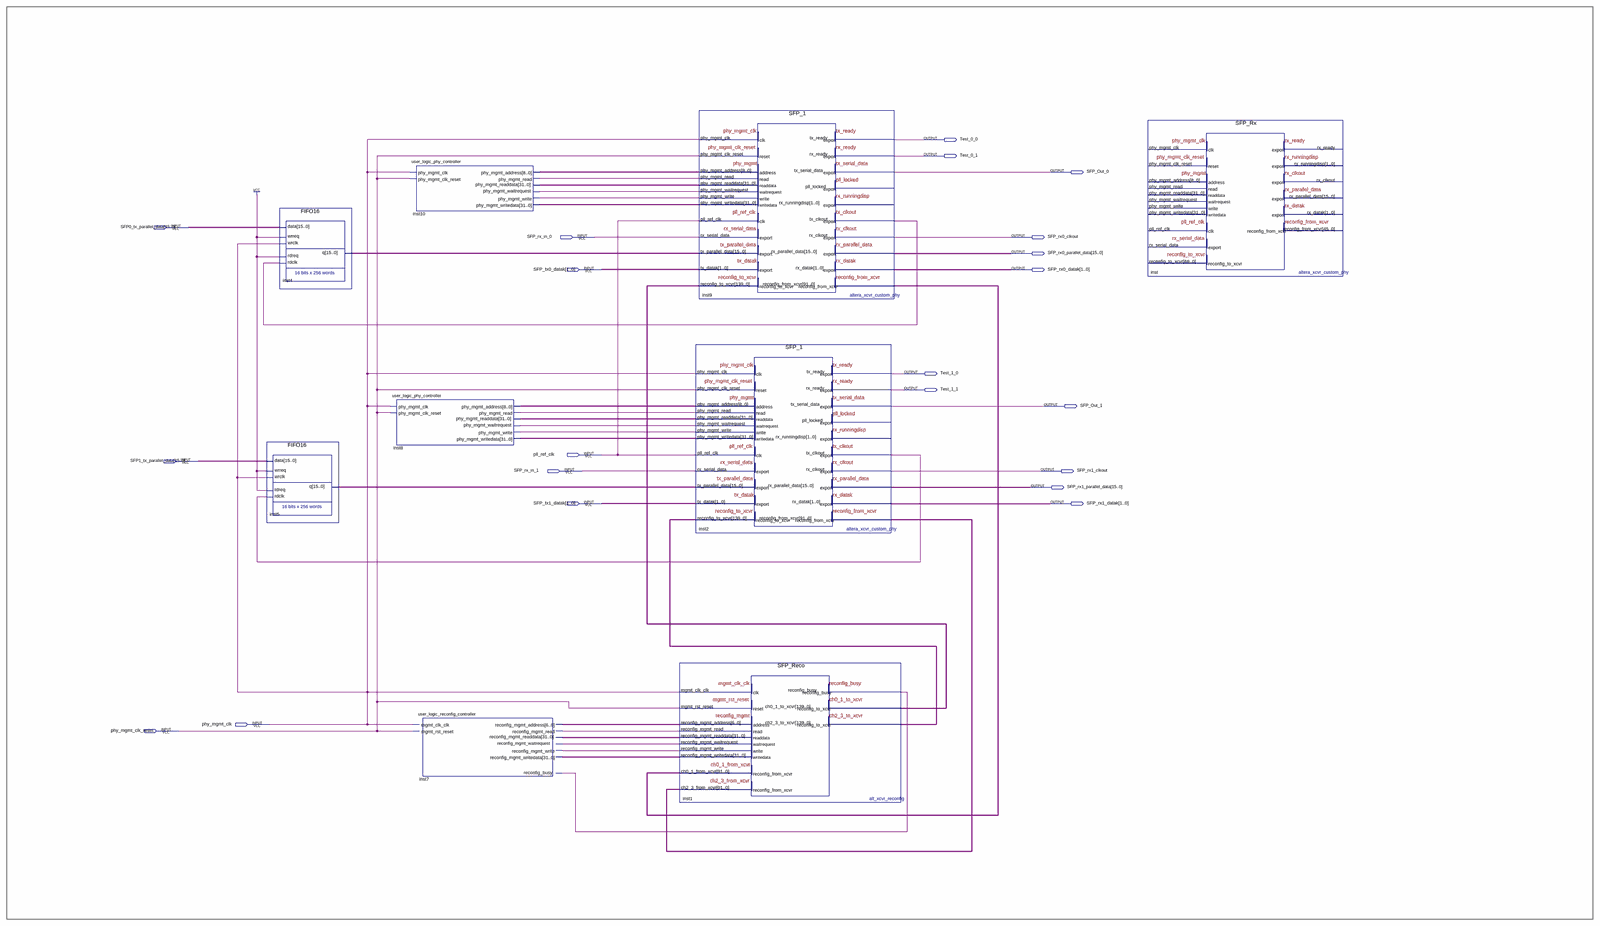
[diagram p0: schematic sheet, whole]
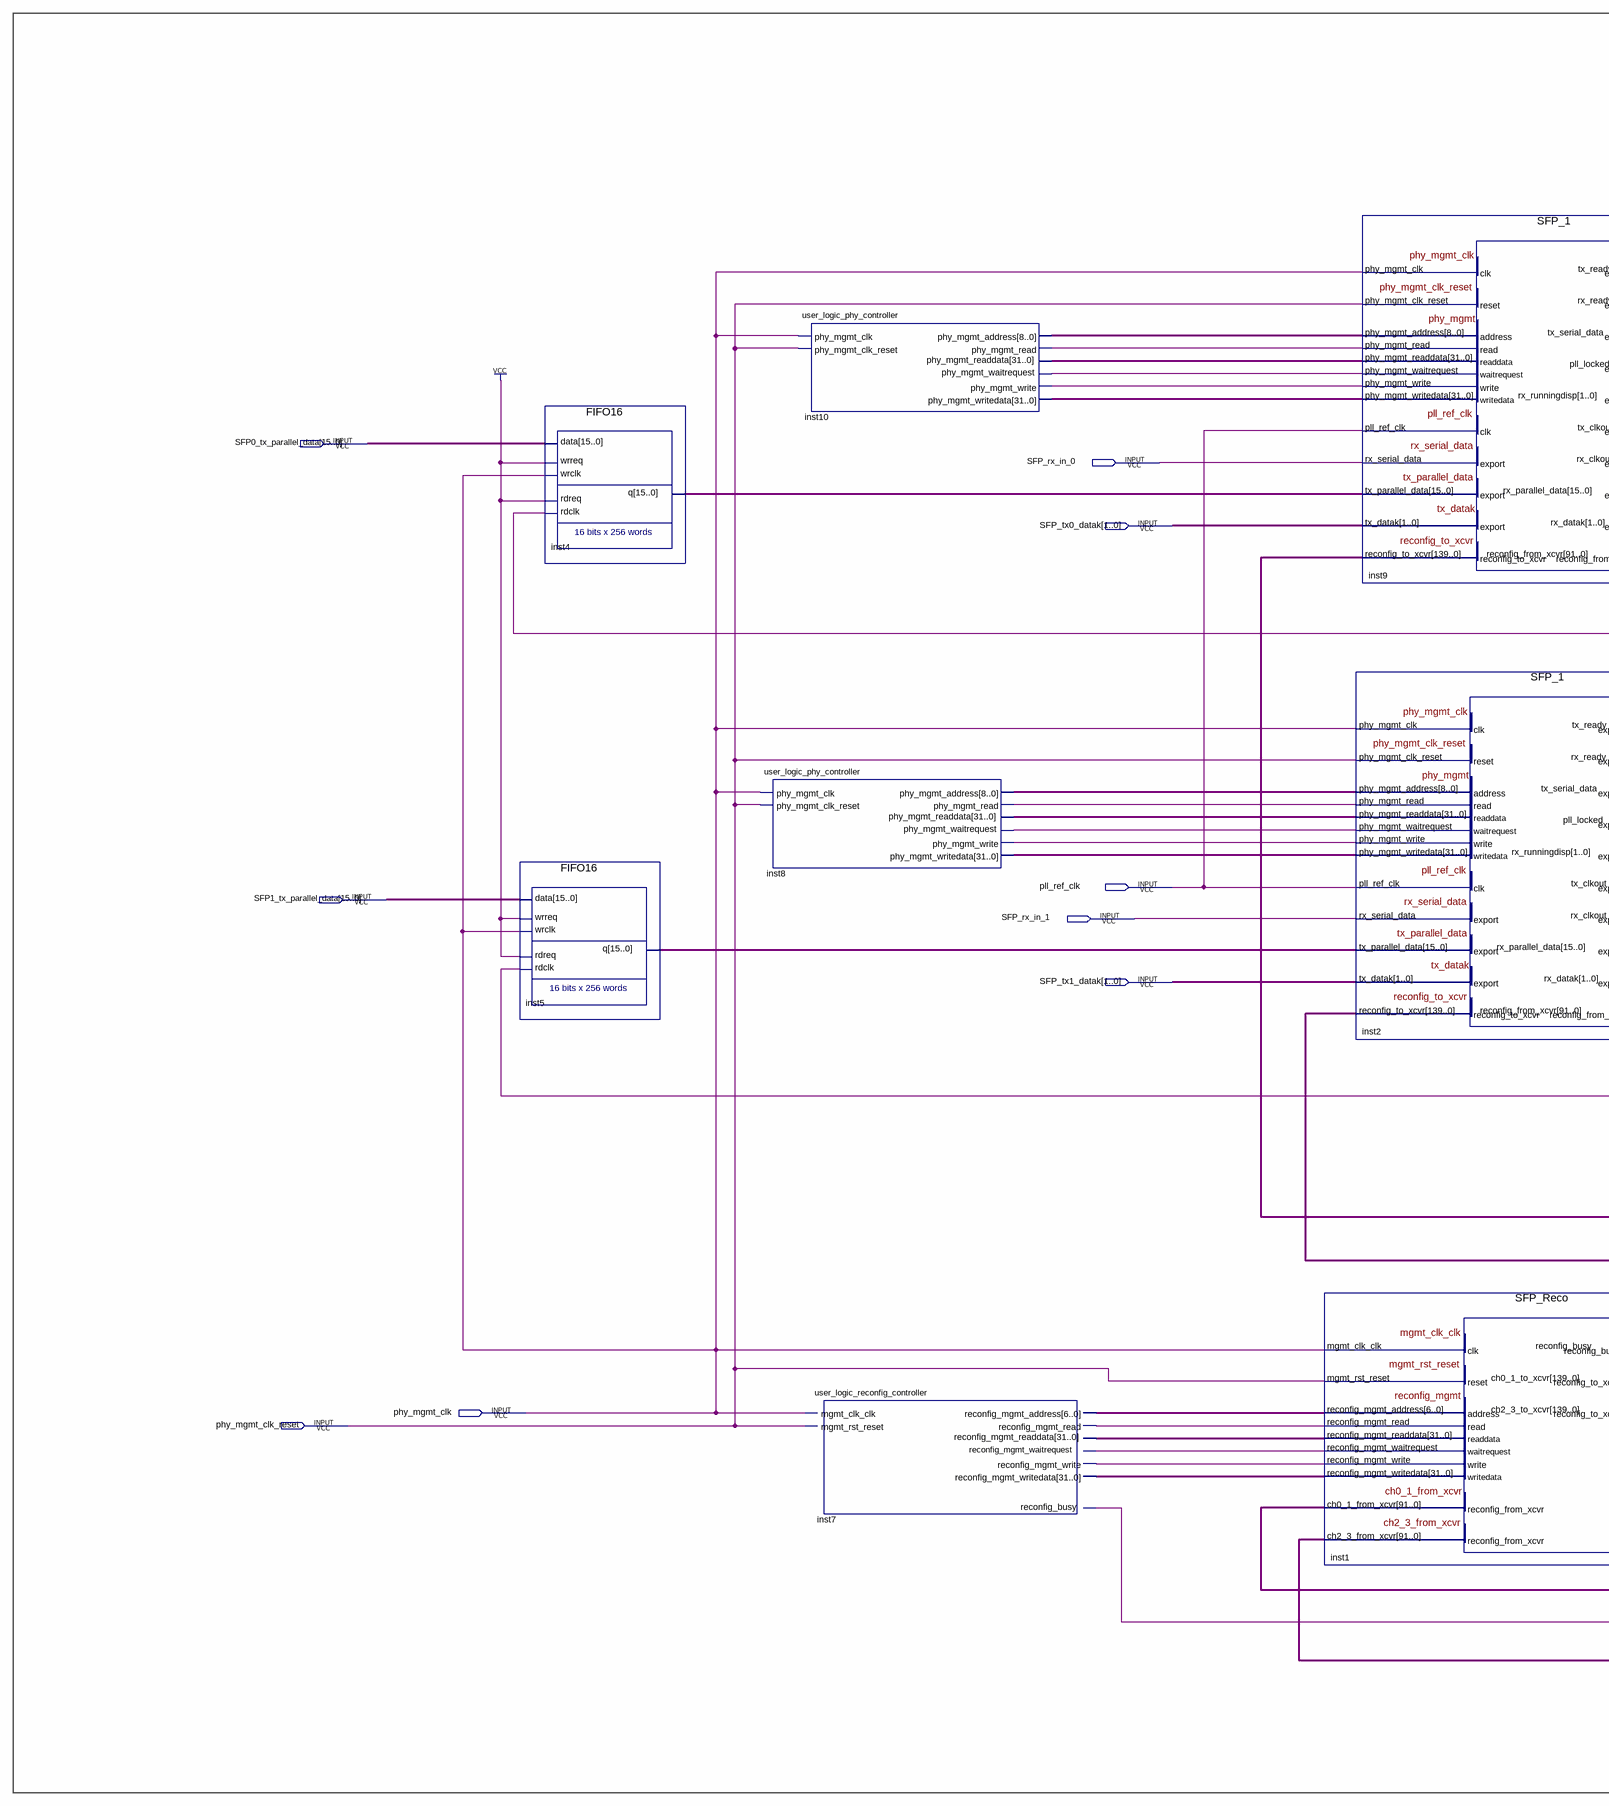
[diagram p1: schematic sheet, left part]
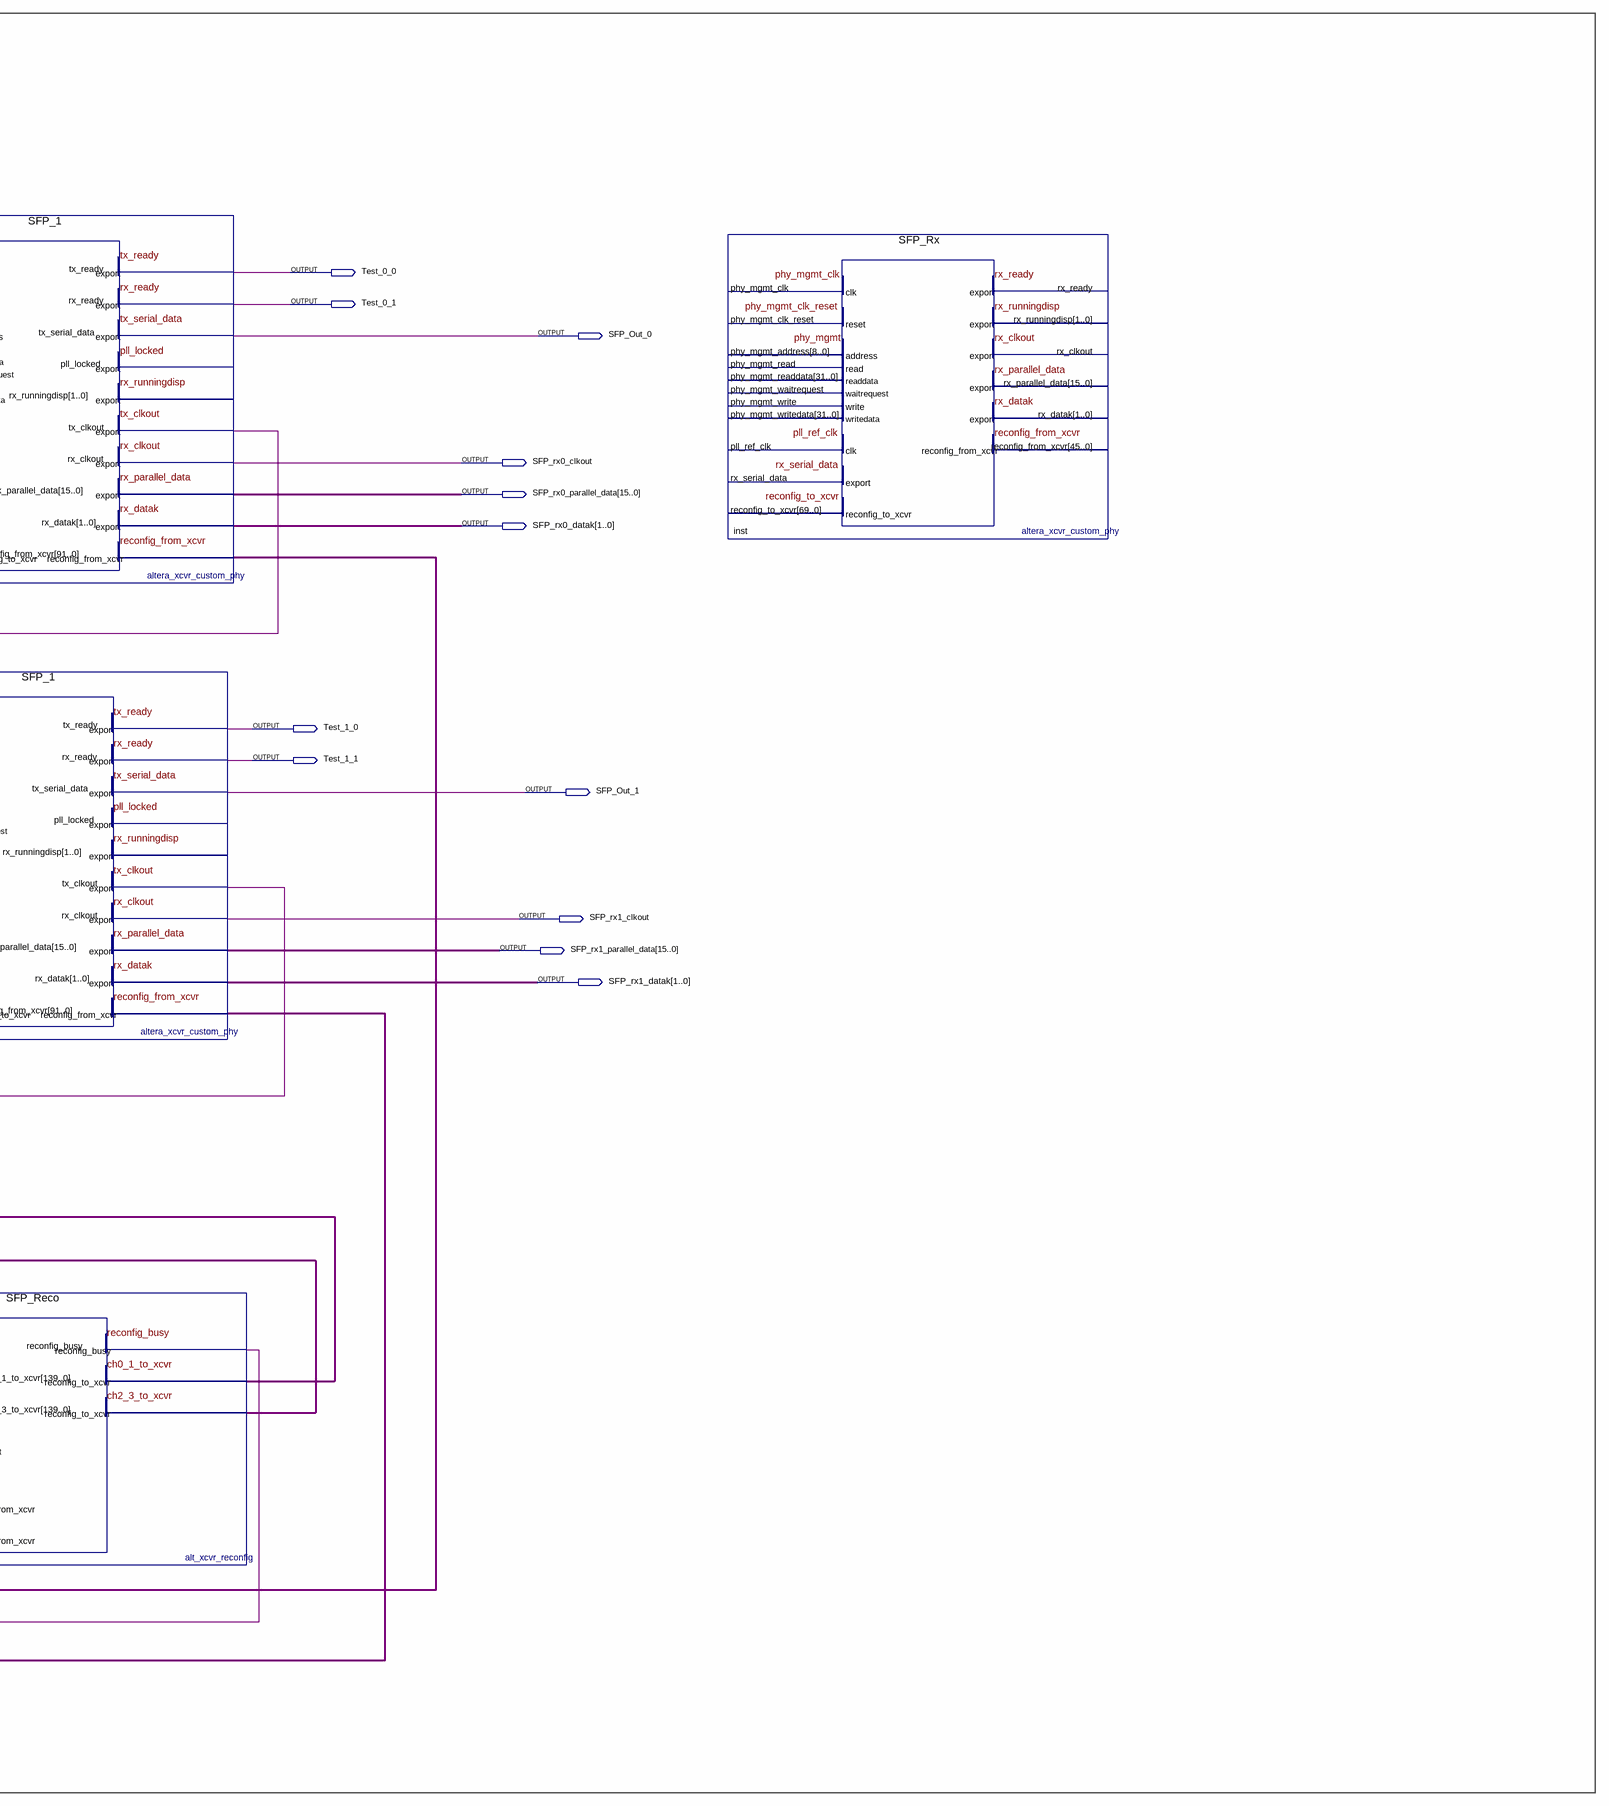
[diagram p2: schematic sheet, right part]
// Quartus schematic SFP_GxBlock_New.bdf as structural Verilog: 9 symbols, 21 pins
module SFP_GxBlock_New (
  input  [15:0] SFP0_tx_parallel_data,
  input  SFP_rx_in_0,
  input  [1:0] SFP_tx0_datak,
  input  pll_ref_clk,
  input  [15:0] SFP1_tx_parallel_data,
  input  SFP_rx_in_1,
  input  [1:0] SFP_tx1_datak,
  input  phy_mgmt_clk,
  input  phy_mgmt_clk_reset,
  output Test_0_0,
  output Test_0_1,
  output SFP_Out_0,
  output SFP_rx0_clkout,
  output [15:0] SFP_rx0_parallel_data,
  output [1:0] SFP_rx0_datak,
  output Test_1_0,
  output Test_1_1,
  output SFP_Out_1,
  output SFP_rx1_clkout,
  output [15:0] SFP_rx1_parallel_data,
  output [1:0] SFP_rx1_datak
);

  wire inst1_reconfig_busy, inst1_reconfig_mgmt_waitrequest, inst2_phy_mgmt_waitrequest, inst2_tx_clkout,
       inst7_reconfig_mgmt_read, inst7_reconfig_mgmt_write, inst8_phy_mgmt_read, inst8_phy_mgmt_write,
       inst9_phy_mgmt_waitrequest, inst9_tx_clkout, inst10_phy_mgmt_read, inst10_phy_mgmt_write;
  wire [6:0] inst7_reconfig_mgmt_address;
  wire [8:0] inst8_phy_mgmt_address, inst10_phy_mgmt_address;
  wire [15:0] inst4_q, inst5_q;
  wire [31:0] inst1_reconfig_mgmt_readdata, inst2_phy_mgmt_readdata, inst7_reconfig_mgmt_writedata,
       inst8_phy_mgmt_writedata, inst9_phy_mgmt_readdata, inst10_phy_mgmt_writedata;
  wire [91:0] inst2_reconfig_from_xcvr, inst9_reconfig_from_xcvr;
  wire [139:0] inst1_ch0_1_to_xcvr, inst1_ch2_3_to_xcvr;

  FIFO16 inst4 (
    .data(SFP0_tx_parallel_data), .wrreq(1'b1), .wrclk(phy_mgmt_clk), .rdreq(1'b1), .rdclk(inst9_tx_clkout),
    .q(inst4_q));
  FIFO16 inst5 (
    .data(SFP1_tx_parallel_data), .wrreq(1'b1), .wrclk(phy_mgmt_clk), .rdreq(1'b1), .rdclk(inst2_tx_clkout),
    .q(inst5_q));
  user_logic_phy_controller inst10 (
    .phy_mgmt_clk(phy_mgmt_clk), .phy_mgmt_clk_reset(phy_mgmt_clk_reset),
    .phy_mgmt_readdata(inst9_phy_mgmt_readdata), .phy_mgmt_waitrequest(inst9_phy_mgmt_waitrequest),
    .phy_mgmt_address(inst10_phy_mgmt_address), .phy_mgmt_read(inst10_phy_mgmt_read),
    .phy_mgmt_write(inst10_phy_mgmt_write), .phy_mgmt_writedata(inst10_phy_mgmt_writedata));
  user_logic_phy_controller inst8 (
    .phy_mgmt_clk(phy_mgmt_clk), .phy_mgmt_clk_reset(phy_mgmt_clk_reset),
    .phy_mgmt_readdata(inst2_phy_mgmt_readdata), .phy_mgmt_waitrequest(inst2_phy_mgmt_waitrequest),
    .phy_mgmt_address(inst8_phy_mgmt_address), .phy_mgmt_read(inst8_phy_mgmt_read),
    .phy_mgmt_write(inst8_phy_mgmt_write), .phy_mgmt_writedata(inst8_phy_mgmt_writedata));
  user_logic_reconfig_controller inst7 (
    .reconfig_busy(inst1_reconfig_busy), .mgmt_clk_clk(phy_mgmt_clk), .mgmt_rst_reset(phy_mgmt_clk_reset),
    .reconfig_mgmt_readdata(inst1_reconfig_mgmt_readdata),
    .reconfig_mgmt_waitrequest(inst1_reconfig_mgmt_waitrequest),
    .reconfig_mgmt_address(inst7_reconfig_mgmt_address), .reconfig_mgmt_read(inst7_reconfig_mgmt_read),
    .reconfig_mgmt_write(inst7_reconfig_mgmt_write), .reconfig_mgmt_writedata(inst7_reconfig_mgmt_writedata));
  SFP_1 inst2 (
    .phy_mgmt_clk(phy_mgmt_clk), .phy_mgmt_clk_reset(phy_mgmt_clk_reset),
    .phy_mgmt_address(inst8_phy_mgmt_address), .phy_mgmt_read(inst8_phy_mgmt_read),
    .phy_mgmt_write(inst8_phy_mgmt_write), .phy_mgmt_writedata(inst8_phy_mgmt_writedata),
    .pll_ref_clk(pll_ref_clk), .rx_serial_data(SFP_rx_in_1), .tx_parallel_data(inst5_q),
    .tx_datak(SFP_tx1_datak), .reconfig_to_xcvr(inst1_ch2_3_to_xcvr),
    .phy_mgmt_readdata(inst2_phy_mgmt_readdata), .phy_mgmt_waitrequest(inst2_phy_mgmt_waitrequest),
    .tx_ready(Test_1_0), .rx_ready(Test_1_1), .tx_serial_data(SFP_Out_1), .tx_clkout(inst2_tx_clkout),
    .rx_clkout(SFP_rx1_clkout), .rx_parallel_data(SFP_rx1_parallel_data), .rx_datak(SFP_rx1_datak),
    .reconfig_from_xcvr(inst2_reconfig_from_xcvr));  // open: pll_locked, rx_runningdisp
  SFP_Reco inst1 (
    .mgmt_clk_clk(phy_mgmt_clk), .mgmt_rst_reset(phy_mgmt_clk_reset),
    .reconfig_mgmt_address(inst7_reconfig_mgmt_address), .reconfig_mgmt_read(inst7_reconfig_mgmt_read),
    .reconfig_mgmt_write(inst7_reconfig_mgmt_write), .reconfig_mgmt_writedata(inst7_reconfig_mgmt_writedata),
    .ch0_1_from_xcvr(inst9_reconfig_from_xcvr), .ch2_3_from_xcvr(inst2_reconfig_from_xcvr),
    .reconfig_busy(inst1_reconfig_busy), .reconfig_mgmt_readdata(inst1_reconfig_mgmt_readdata),
    .reconfig_mgmt_waitrequest(inst1_reconfig_mgmt_waitrequest), .ch0_1_to_xcvr(inst1_ch0_1_to_xcvr),
    .ch2_3_to_xcvr(inst1_ch2_3_to_xcvr));
  SFP_1 inst9 (
    .phy_mgmt_clk(phy_mgmt_clk), .phy_mgmt_clk_reset(phy_mgmt_clk_reset),
    .phy_mgmt_address(inst10_phy_mgmt_address), .phy_mgmt_read(inst10_phy_mgmt_read),
    .phy_mgmt_write(inst10_phy_mgmt_write), .phy_mgmt_writedata(inst10_phy_mgmt_writedata),
    .pll_ref_clk(pll_ref_clk), .rx_serial_data(SFP_rx_in_0), .tx_parallel_data(inst4_q),
    .tx_datak(SFP_tx0_datak), .reconfig_to_xcvr(inst1_ch0_1_to_xcvr),
    .phy_mgmt_readdata(inst9_phy_mgmt_readdata), .phy_mgmt_waitrequest(inst9_phy_mgmt_waitrequest),
    .tx_ready(Test_0_0), .rx_ready(Test_0_1), .tx_serial_data(SFP_Out_0), .tx_clkout(inst9_tx_clkout),
    .rx_clkout(SFP_rx0_clkout), .rx_parallel_data(SFP_rx0_parallel_data), .rx_datak(SFP_rx0_datak),
    .reconfig_from_xcvr(inst9_reconfig_from_xcvr));  // open: pll_locked, rx_runningdisp
  SFP_Rx inst ();  // open: phy_mgmt_clk, phy_mgmt_clk_reset, phy_mgmt_address, phy_mgmt_read, phy_mgmt_write, phy_mgmt_writedata, pll_ref_clk, rx_serial_data, reconfig_to_xcvr, phy_mgmt_readdata, phy_mgmt_waitrequest, rx_ready, rx_runningdisp, rx_clkout, rx_parallel_data, rx_datak, reconfig_from_xcvr
endmodule
